# Altium schematic sheet Sensors.SchDoc
size A4
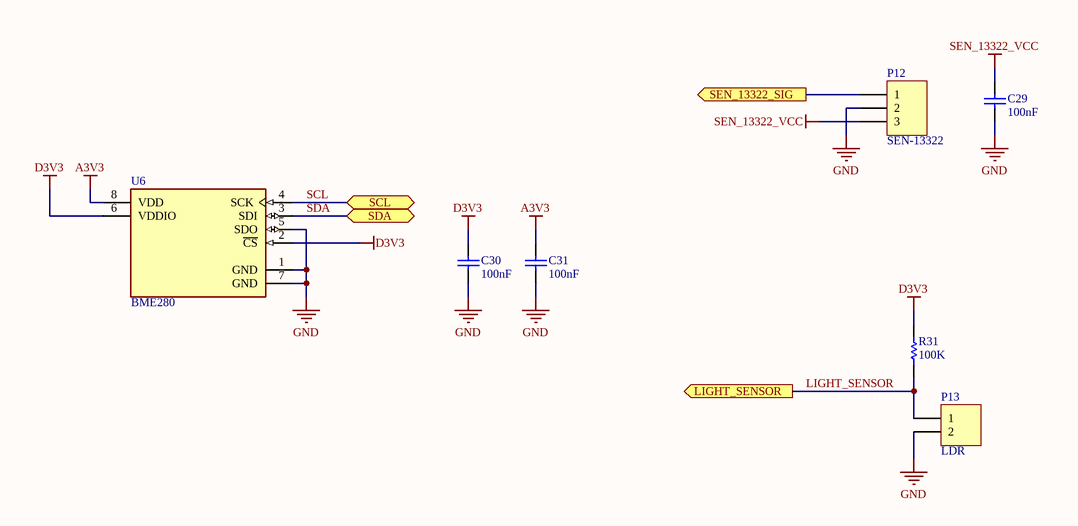
[diagram p0: Sensors.SchDoc]

## Parts
C29  100nF  [CAP0603]
C30  100nF  [CAP0603]
C31  100nF  [CAP0603]
P12  SEN-13322  [MOLEX MICROLATCH 3CT]
P13  LDR  [MOLEX MICROLATCH 2CT]
R31  100K  [RES0603]
U6  BME280  [BME280]

## Ports
LIGHT_SENSOR (out), SCL (bidir), SDA (bidir), SEN_13322_SIG (out)

## Nets
A3V3: C31.2 U6.8(VDD)
D3V3: C30.2 R31.2 U6.2(~{CS}) U6.6(VDDIO)
GND: C29.1 C30.1 C31.1 P12.2 P13.2 U6.1(GND) U6.5(SDO) U6.7(GND)
SEN_13322_VCC: C29.2 P12.3
LIGHT_SENSOR: P13.1 R31.1 ; port LIGHT_SENSOR
SCL: U6.4(SCK) ; port SCL
SDA: U6.3(SDI) ; port SDA
SEN_13322_SIG: P12.1 ; port SEN_13322_SIG

## Library data of the parts
C29-C31 = Capacitor: Published: 8-Jun-2000; LatestRevisionDate: 17-Jul-2002; LatestRevisionNote: Re-released for DXP Platform.; PackageReference: RAD-0.3; Publisher: Altium Limited; PackageDescription: Radial Cap, Thru-Hole; 2 Leads; 0.3 in Pin Spacing; Value: Value
P12 = 3X1 2.54MM: Header, 3-Pin; LatestRevisionDate: 17-Jul-2002; LatestRevisionNote: Re-released for DXP Platform.; Publisher: Altium Limited
P13 = 2X1 2.54MM: Header, 2-Pin; LatestRevisionDate: 17-Jul-2002; LatestRevisionNote: Re-released for DXP Platform.; Publisher: Altium Limited
R31 = Resistor: Published: 8-Jun-2000; LatestRevisionDate: 17-Jul-2002; LatestRevisionNote: Re-released for DXP Platform.; PackageReference: AXIAL-0.3; Publisher: Altium Limited; PackageDescription: Axial Device, Thru-Hole; 2 Leads; 0.3 in Pin Spacing; Value: Value
U6 = BME280: SENSOR PRESSURE HUMIDITY TEMP; Sensor Type: Temperature; Accuracy: 3%; Response Time: 1s; Output Type: SPI; Min Operating Temperature: -40°C; Max Operating Temperature: 85°C; Case/Package: LGA; Packaging: Cut Tape; Mount: Surface Mount; Lead Free: Lead Free; Number of Pins: 8